# EAGLE design Programmable DC Load (EAGLE 9.6.2)

## Sheet 1 of 2
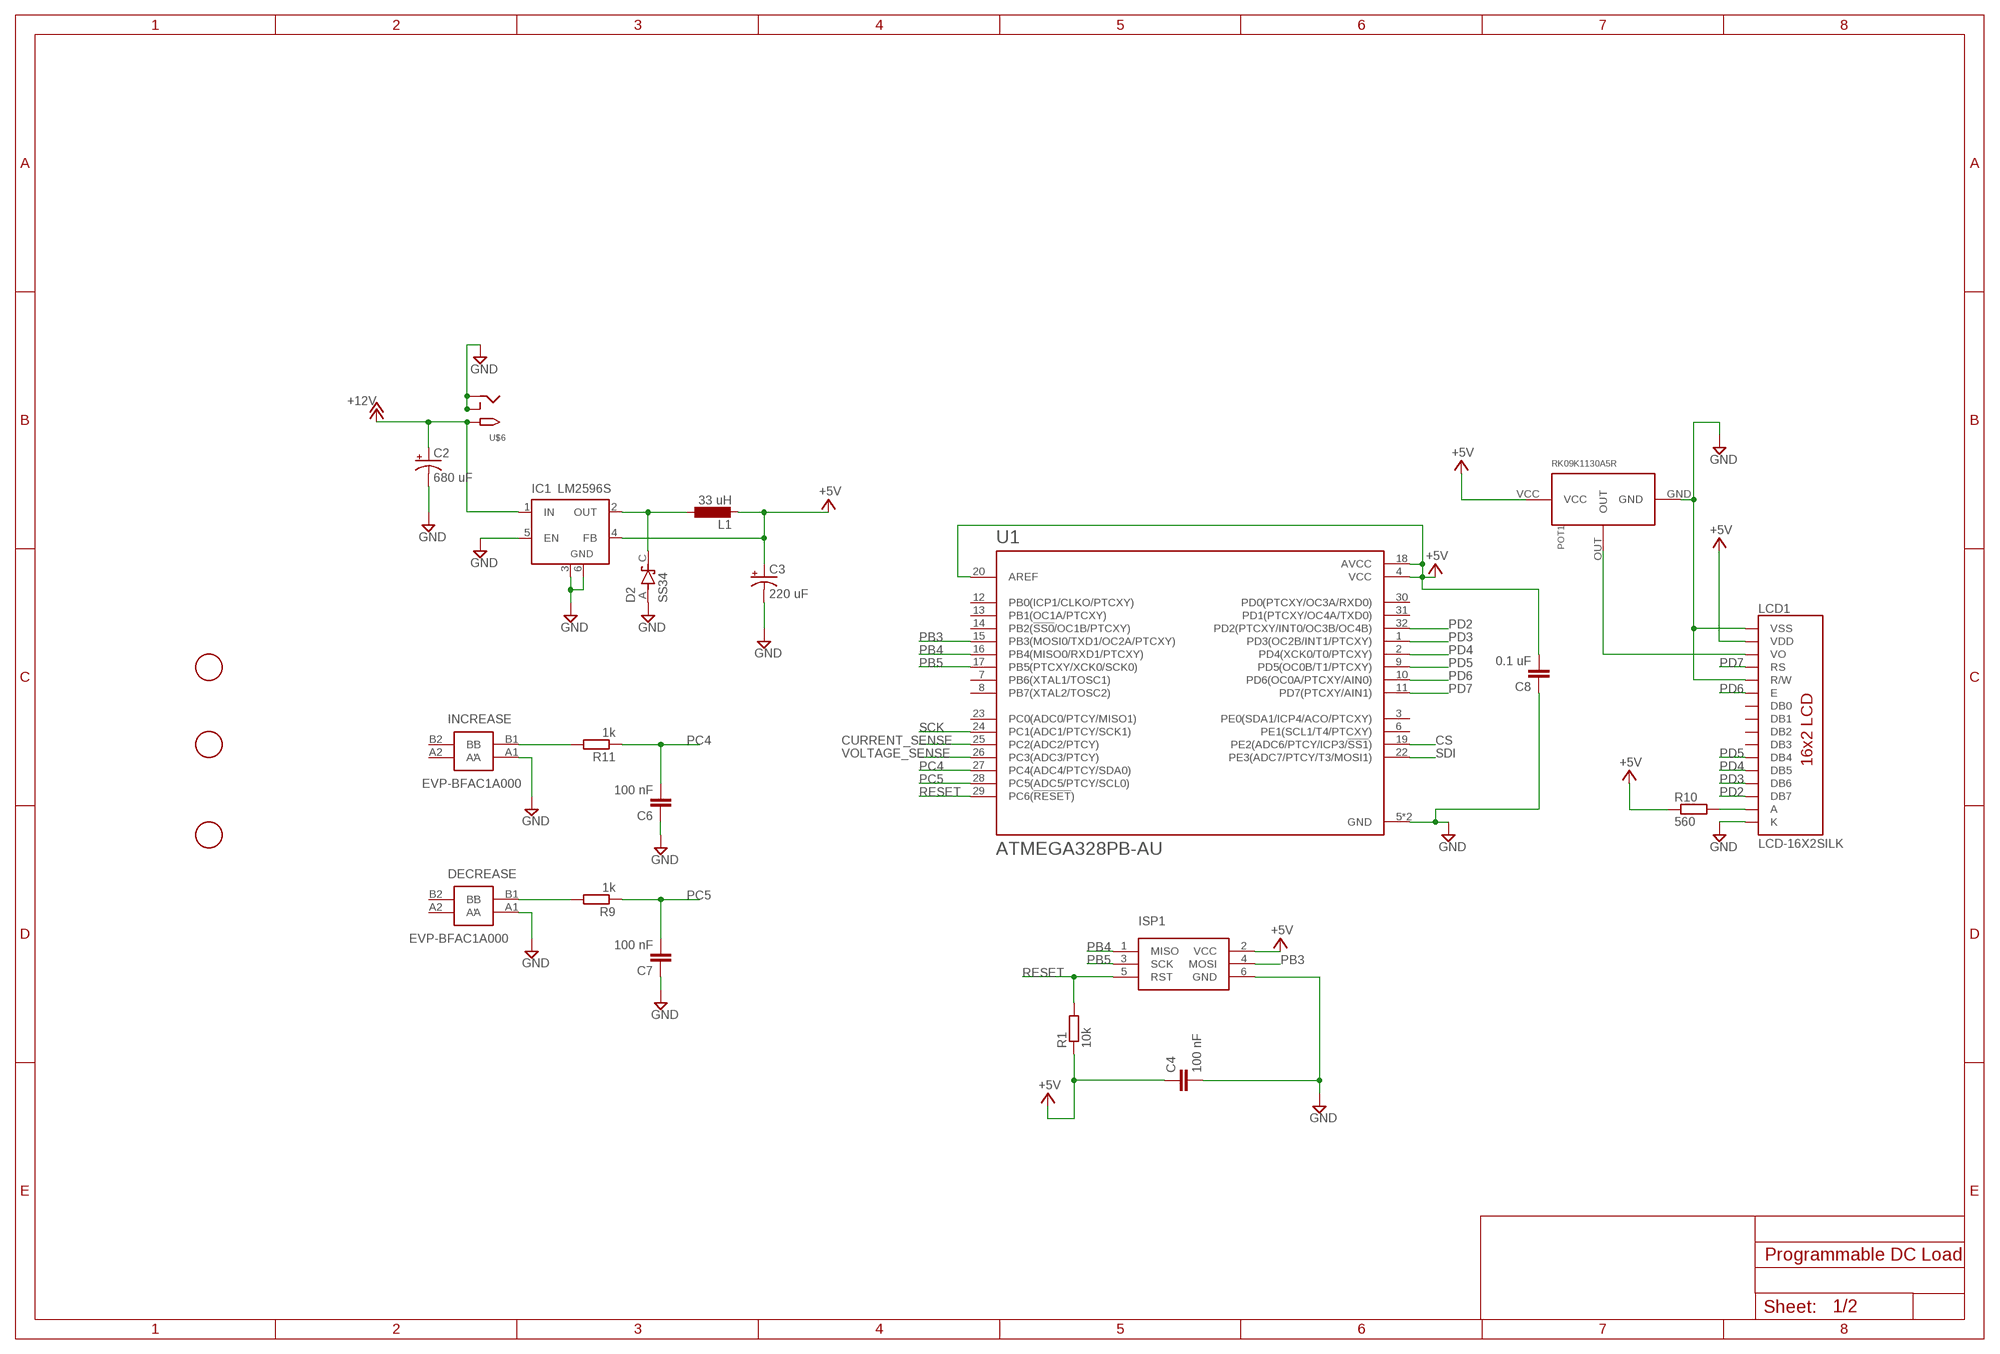
[diagram p0: schematic, sheet 1]

### Parts
C2  680 uF  CPOL-US140CLH-0810  [140CLH-0810]
C3  220 uF  CPOL-US140CLH-0810  [140CLH-0810]
C4  100 nF  C-EUC0805  [C0805]
C6  100 nF  C-EUC0805  [C0805]
C7  100 nF  C-EUC0805  [C0805]
C8  0.1 uF  C-EUC0805  [C0805]
D2  SS34  [DIOM7959X265N]
DECREASE  EVP-BFAC1A000  [EVPBFAC1A000]
IC1  LM2596S  [TO263-5]
INCREASE  EVP-BFAC1A000  [EVPBFAC1A000]
ISP1  AVRISP-6  [AVRISP]
L1  33 uH  L-EUL1812  [L1812]
LCD1  LCD-16X2SILK  [LCD-16X2]
POT1  RK09K1130A5R  [RK09K1130A5R]
R1  10k  R-EU_R0805  [R0805]
R9  1k  R-EU_R0805  [R0805]
R10  560  R-EU_R0805  [R0805]
R11  1k  R-EU_R0805  [R0805]
U1  ATMEGA328PB-AU  [QFP80P900X900X120-32N]
U$2  FIDUCIAL  [FIDUCIAL_1MM]
U$3  FIDUCIAL  [FIDUCIAL_1MM]
U$4  FIDUCIAL  [FIDUCIAL_1MM]
U$6  2.1MMJACKTHM  [PJ-102A]

### Nets
+5V: C3.+ C4.1 C8.2 IC1.4(FB) ISP1.2(VCC) L1.2 LCD1.2(VDD) POT1.VCC R1.1 R10.1 U1.4(VCC) U1.18(AVCC) U1.20(AREF) ; also sheet 2
+12V: C2.+ IC1.1(IN) U$6.TIP ; also sheet 2
CS: U1.19(PE2(ADC6/PTCY/ICP3/!SS1!)) ; also sheet 2
CURRENT_SENSE: U1.25(PC2(ADC2/PTCY)) ; also sheet 2
GND: C2.- C3.- C4.2 C6.1 C7.1 C8.1 D2.A DECREASE.A1(A) IC1.3(GND) IC1.5(EN) IC1.6(GND) INCREASE.A1(A) ISP1.6(GND) LCD1.1(VSS) LCD1.5(R/W) LCD1.16(K) POT1.GND U1.5(GND) U1.21(GND) U$6.RING U$6.RING_SW ; also sheet 2
N$3: LCD1.15(A) R10.2
N$4: D2.C(K) IC1.2(OUT) L1.1
N$6: DECREASE.B1(B) R9.2
N$8: INCREASE.B1(B) R11.2
N$12: LCD1.3(VO) POT1.OUT
PB3: ISP1.4(MOSI) U1.15(PB3(MOSI0/TXD1/OC2A/PTCXY))
PB4: ISP1.1(MISO) U1.16(PB4(MISO0/RXD1/PTCXY))
PB5: ISP1.3(SCK) U1.17(PB5(PTCXY/XCK0/SCK0))
PC4: C6.2 R11.1 U1.27(PC4(ADC4/PTCY/SDA0))
PC5: C7.2 R9.1 U1.28(PC5(ADC5/PTCY/SCL0))
PD2: LCD1.14(DB7) U1.32(PD2(PTCXY/INT0/OC3B/OC4B))
PD3: LCD1.13(DB6) U1.1(PD3(OC2B/INT1/PTCXY))
PD4: LCD1.12(DB5) U1.2(PD4(XCK0/T0/PTCXY))
PD5: LCD1.11(DB4) U1.9(PD5(OC0B/T1/PTCXY))
PD6: LCD1.6(E) U1.10(PD6(OC0A/PTCXY/AIN0))
PD7: LCD1.4(RS) U1.11(PD7(PTCXY/AIN1))
RESET: ISP1.5(RST) R1.2 U1.29(PC6(!RESET!))
SCK: U1.24(PC1(ADC1/PTCY/SCK1)) ; also sheet 2
SDI: U1.22(PE3(ADC7/PTCY/T3/MOSI1)) ; also sheet 2
VOLTAGE_SENSE: U1.26(PC3(ADC3/PTCY)) ; also sheet 2
Unconnected: DECREASE.A2(A') DECREASE.B2(B') INCREASE.A2(A') INCREASE.B2(B') LCD1.7(DB0) LCD1.8(DB1) LCD1.9(DB2) LCD1.10(DB3) U1.3(PE0(SDA1/ICP4/ACO/PTCXY)) U1.6(PE1(SCL1/T4/PTCXY)) U1.7(PB6(XTAL1/TOSC1)) U1.8(PB7(XTAL2/TOSC2)) U1.12(PB0(ICP1/CLKO/PTCXY)) U1.13(PB1(OC1A/PTCXY)) U1.14(PB2(!SS0!/OC1B/PTCXY)) U1.23(PC0(ADC0/PTCY/MISO1)) U1.30(PD0(PTCXY/OC3A/RXD0)) U1.31(PD1(PTCXY/OC4A/TXD0))

## Sheet 2 of 2
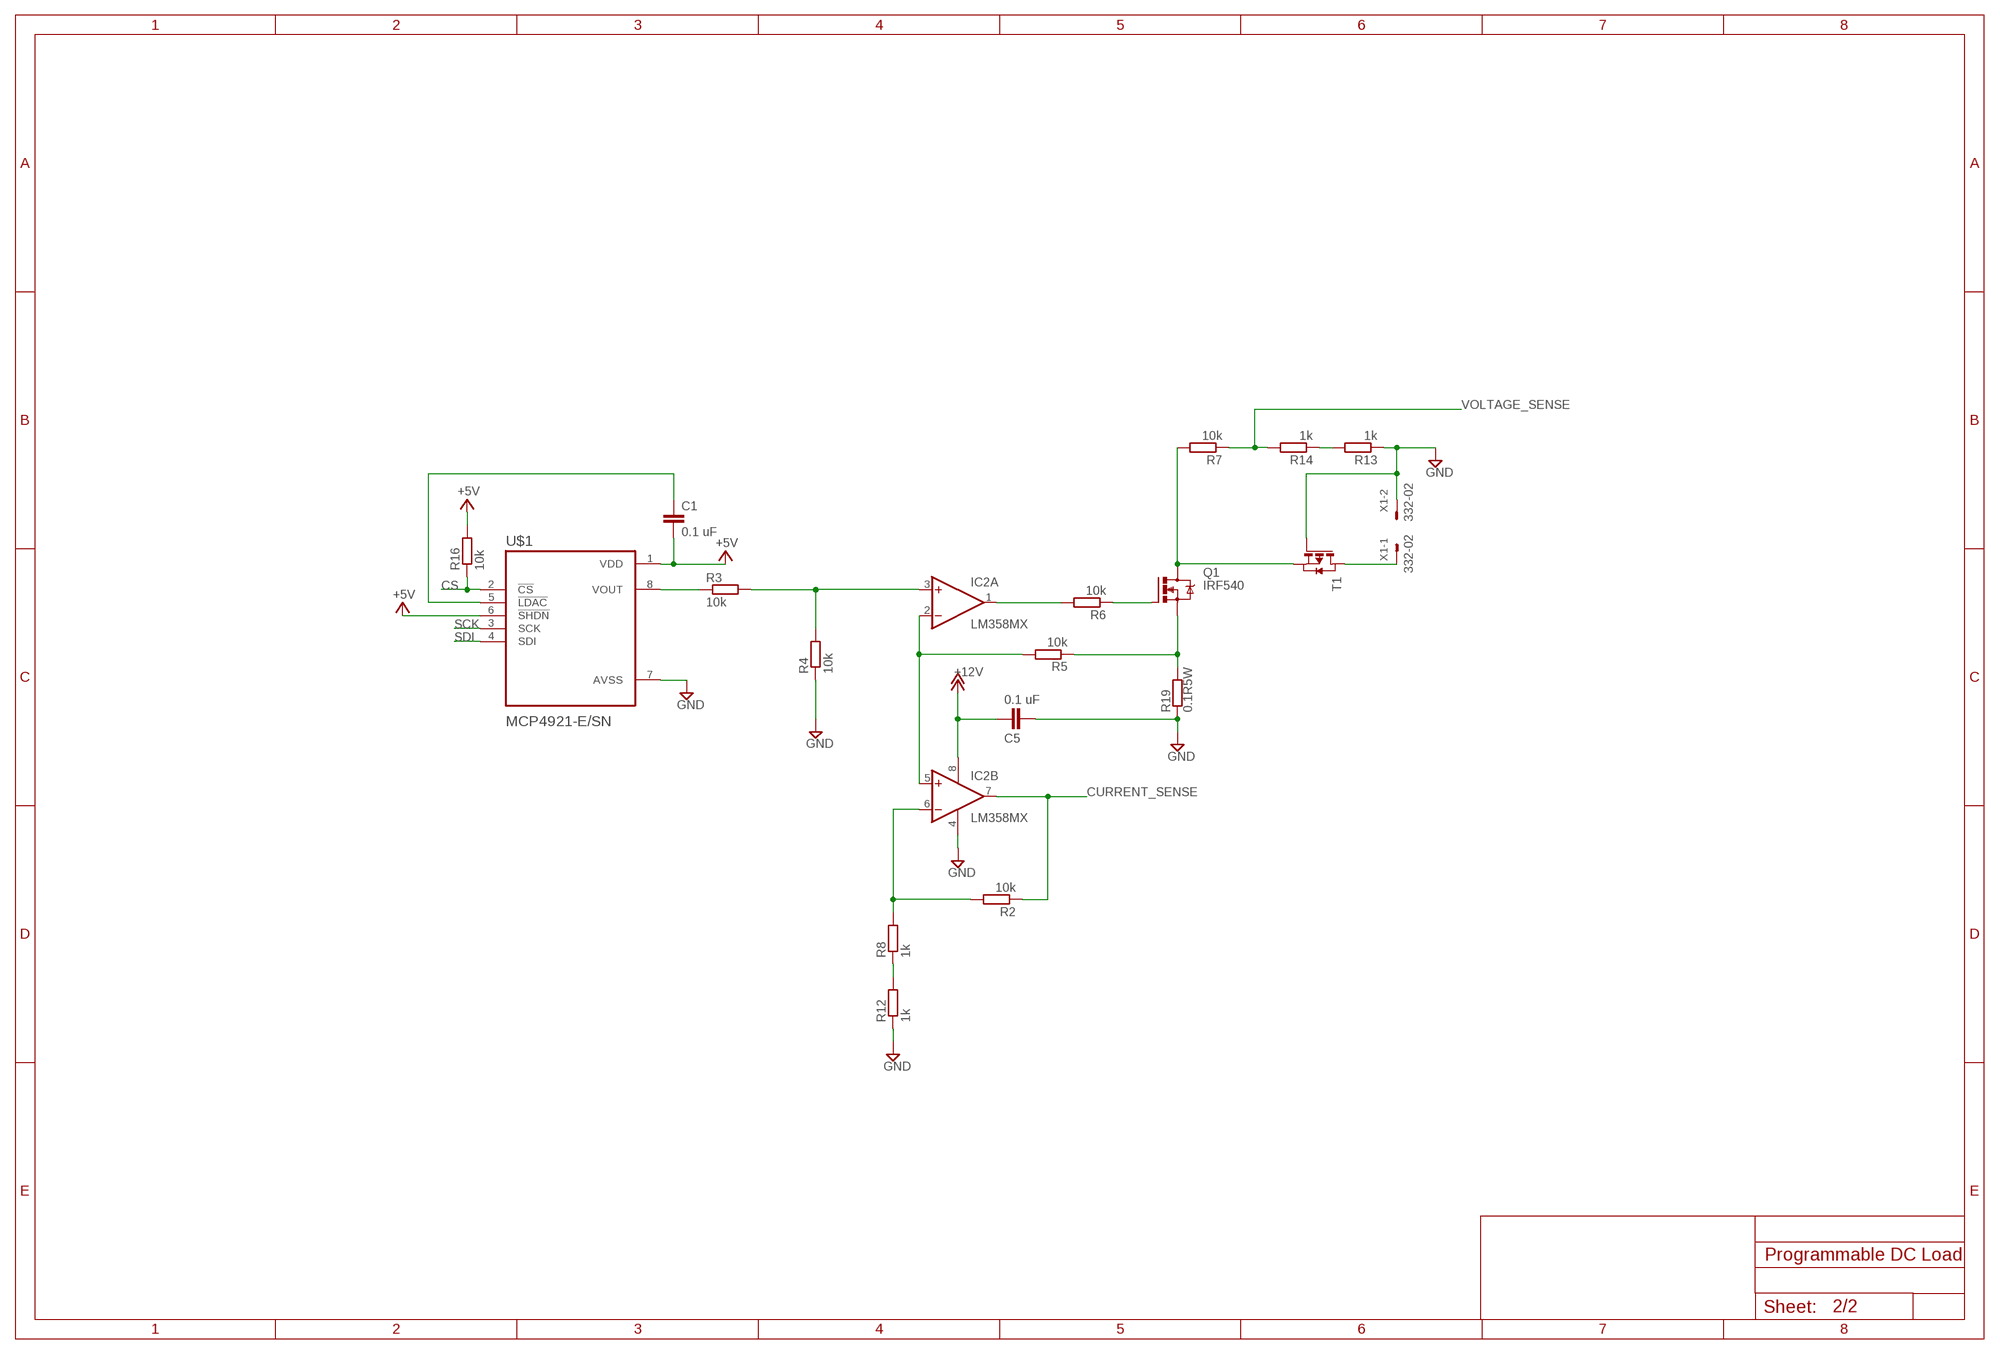
[diagram p1: schematic, sheet 2]

### Parts
C1  0.1 uF  C-EUC0805  [C0805]
C5  0.1 uF  C-EUC0805  [C0805]
IC2  LM358MX  [SO08]
Q1  IRF540  [TO220BV]
R2  10k  R-EU_R0805  [R0805]
R3  10k  R-EU_R0805  [R0805]
R4  10k  R-EU_R0805  [R0805]
R5  10k  R-EU_R0805  [R0805]
R6  10k  R-EU_R0805  [R0805]
R7  10k  R-EU_R0805  [R0805]
R8  1k  R-EU_R0805  [R0805]
R12  1k  R-EU_R0805  [R0805]
R13  1k  R-EU_R0805  [R0805]
R14  1k  R-EU_R0805  [R0805]
R16  10k  R-EU_R0805  [R0805]
R19  0.1R5W  BVS  [BVS]
T1  PMOSSOT23  [SOT-23]
U$1  MCP4921-E/SN  [SOIC127P600X175-8N]
X1  332-02  [332-02]

### Nets
+5V: C1.2 R16.2 U$1.1(VDD) U$1.6(!SHDN) ; also sheet 1
+12V: C5.2 IC2.8(P:V+) ; also sheet 1
CS: R16.1 U$1.2(!CS) ; also sheet 1
CURRENT_SENSE: IC2.7(B:OUT) R2.1 ; also sheet 1
GND: C5.1 IC2.4(P:V-) R4.1 R12.1 R13.1 R19.2 T1.3(G) U$1.7(AVSS) X1.2 ; also sheet 1
N$1: R8.1 R12.2
N$2: R13.2 R14.1
N$5: T1.1(D) X1.1
N$10: IC2.3(A:+IN) R3.2 R4.2
N$16: IC2.1(A:OUT) R6.2
N$18: Q1.G R6.1
N$19: IC2.2(A:-IN) IC2.5(B:+IN) R5.2
N$20: Q1.S R5.1 R19.1
N$21: Q1.D R7.2 T1.2(S)
N$22: IC2.6(B:-IN) R2.2 R8.2
N$23: R3.1 U$1.8(VOUT)
N$24: C1.1 U$1.5(!LDAC)
SCK: U$1.3(SCK) ; also sheet 1
SDI: U$1.4(SDI) ; also sheet 1
VOLTAGE_SENSE: R7.1 R14.2 ; also sheet 1

## Library data of the parts
C1 C4-C8 = rcl:C-EU: CAPACITOR, European symbol; SPICEPREFIX: C
C2 C3 = rcl:CPOL-US: POLARIZED CAPACITOR, American symbol; SPICEPREFIX: C
D2 = SS34:SS34: Diode Schottky 40V 3A 2-Pin SMC T/R Check prices <https://pricing.snapeda.com/parts/SS34/ON%20Semiconductor/view-part?ref=eda>; AVAILABILITY: Good; DESCRIPTION: Diode Schottky 40V 3A Surface Mount SMC (DO-214AB); MF: ON Semiconductor; MP: SS34; PACKAGE: SMC-2 ON Semiconductor; PRICE: None; PURCHASE-URL: https://pricing.snapeda.com/search/part/SS34/?ref=eda
DECREASE INCREASE = EVP-BFAC1A000:EVP-BFAC1A000: Tactile Switches 6.0x6.0x3.4mm 2N w/4 Term .25mm Trvl IP67 Source: Datasheet <https://industrial.panasonic.com/cdbs/www-data/pdf/ATK0000/ATK0000C432.pdf> Check prices <https://pricing.snapeda.com/parts/EVP-BFAC1A000/Panasonic%20Electronic/view-part?ref=eda>; AVAILABILITY: Warning; DESCRIPTION: Tactile Switch SPST-NO Top Actuated Surface Mount; MF: Panasonic Electronic; MP: EVP-BFAC1A000; PACKAGE: None; PRICE: None; PURCHASE-URL: https://pricing.snapeda.com/search/part/EVP-BFAC1A000/?ref=eda
IC1 = linear:LM2596S: STEP-DOWN VOLTAGE REGULATOR
IC2 = linear:LM358: OP AMP also LM158; LM258; LM2904 Source: http://cache.national.com/ds/LM/LM158.pdf
ISP1 = ECE388:AVRISP: AVR ISP HEADER Standard 6 pin header for AVR programming
L1 = rcl:L-EU: INDUCTOR, European symbol; SPICEPREFIX: L
LCD1 = SparkFun-Displays:LCD-16X2: Standard text-only 16x2 parallel input LCD Basic 16 character by 2 line display. Typically utilizes the extremely common HD44780 parallel interface chipset SparkFun Products: Basic 16x2 Green <https://www.sparkfun.com/products/255> Basic 8x2 Green <https://www.sparkfun.com/products/11122>; PROD_ID: LCD-12633; SF_ID: LCD-00255
POT1 = RK09K1130A5R:RK09K1130A5R
Q1 = transistor-power:IRF540: HEXFET Power MOSFET
R1-R14 R16 = rcl:R-EU_: RESISTOR, European symbol; SPICEPREFIX: R
R19 = resistor-shunt:BVS: SMD SHUNT RESISTOR; OC_FARNELL: unknown; OC_NEWARK: unknown
T1 = zetex:PMOSSOT23: MOS FET; OC_FARNELL: unknown; OC_NEWARK: unknown
U1 = ATMEGA328PB-AU:ATMEGA328PB-AU: ATmega Series 20 MHz 32 KB Flash 2 KB SRAM 8-Bit Microcontroller - TQFP-32 Check prices <https://pricing.snapeda.com/search/part/ATMEGA328PB-AU/?ref=eda>; AVAILABILITY: Good; DESCRIPTION: 8-bit Microcontrollers - MCU ATMEGA328PB 20MHZ IND TEMP; MF: Microchip Technology / Atmel; MP: ATMEGA328PB-AU; PACKAGE: None; PRICE: None; PURCHASE-URL: https://pricing.snapeda.com/search/part/ATMEGA328PB-AU/?ref=eda
U$1 = MCP4921-E_SN:MCP4921-E/SN: Check prices <https://pricing.snapeda.com/parts/MCP4921-E/SN/Microchip/view-part?ref=eda>; AVAILABILITY: Good; DESCRIPTION: 12 Bit Digital to Analog Converter 1 8-SOIC; MF: Microchip; MP: MCP4921-E/SN; PACKAGE: SOIC-8 Microchip; PRICE: None; PURCHASE-URL: https://pricing.snapeda.com/search/part/MCP4921-E/SN/?ref=eda
U$2-U$4 = ECE388:FIDUCIAL: For use by pick and place machines to calibrate the vision/machine, 1mm By microbuilder.eu
U$6 = ECE388:2.1MMJACK: 2.1mm x 5.5mm THM DC jack with internal switch. Digikey part #PJ-102A, 4UCON part #05537 2.1mm x 5.5mm SMT DC jack with internal switch. Digikey part #PJ-002A-SMT, 4UCON part #03267 By microbuilder.eu & adafruit.com
X1 = con-garry:332-02: 2 Pin - 2mm Dual Row Source: www.mpe-connector.de / garry_shortform_2012.pdf

## Board
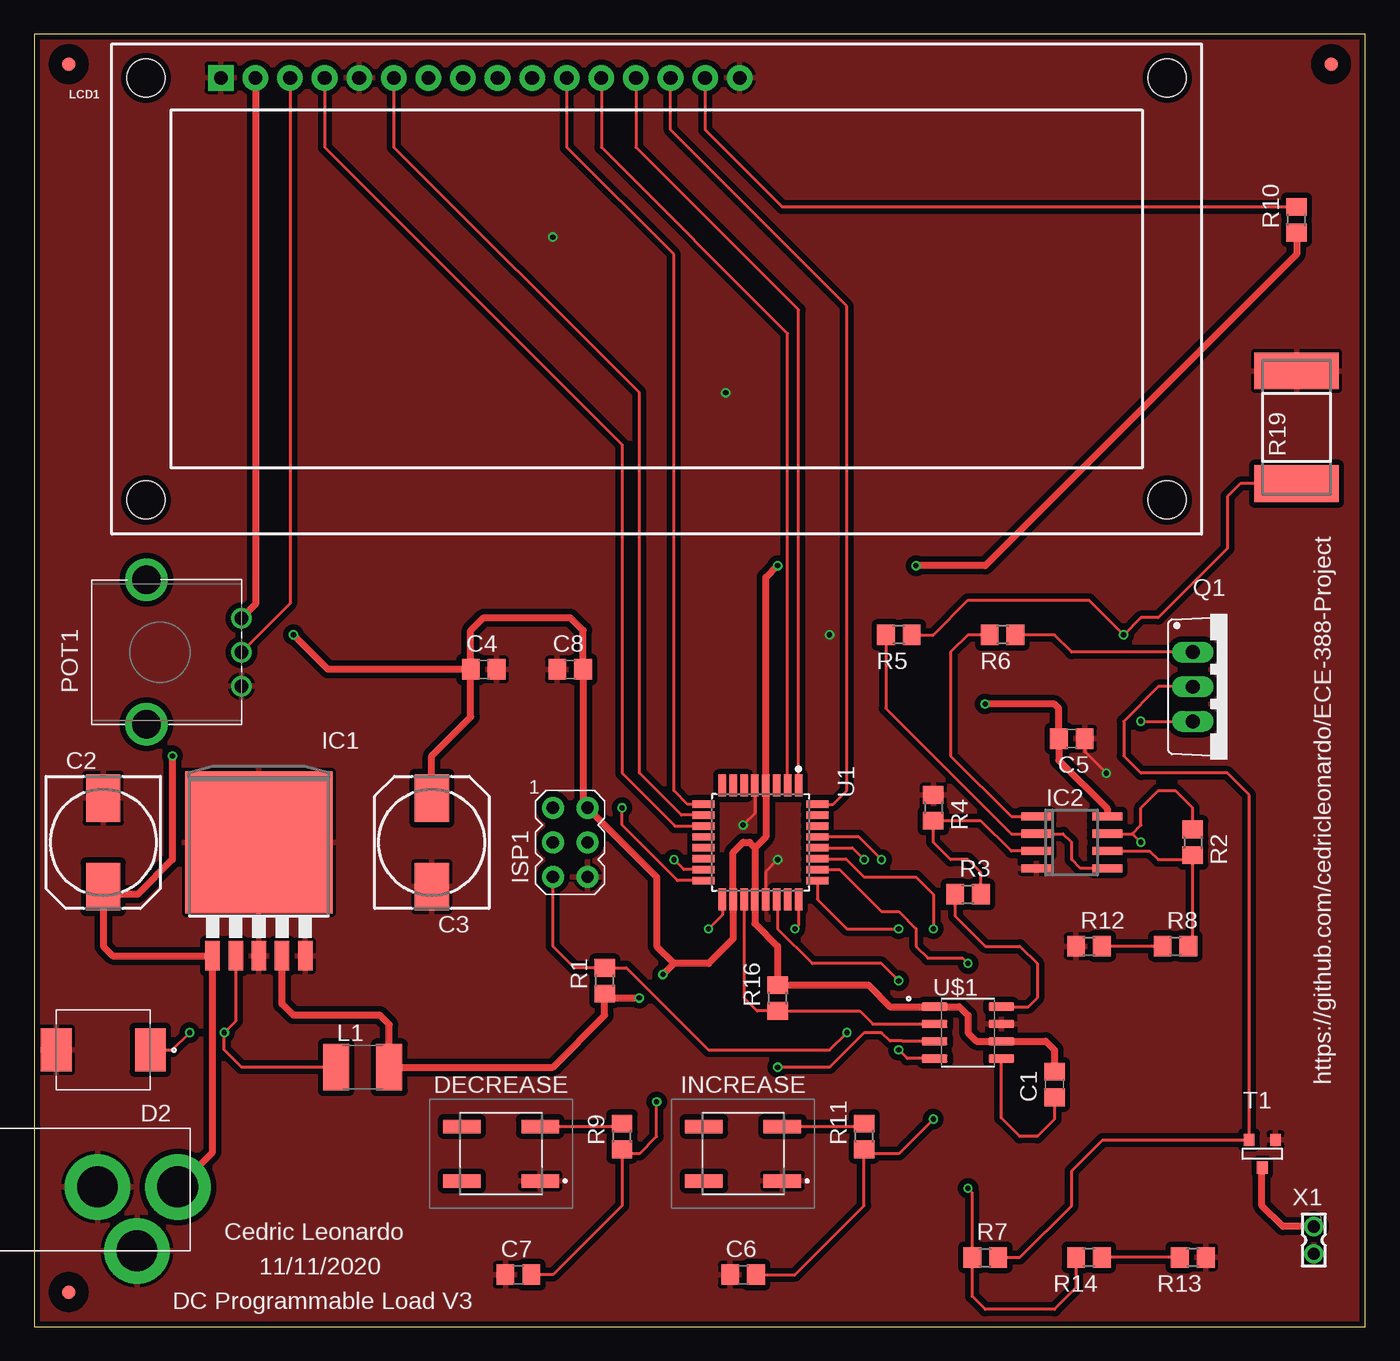
[diagram p2: board, top side]
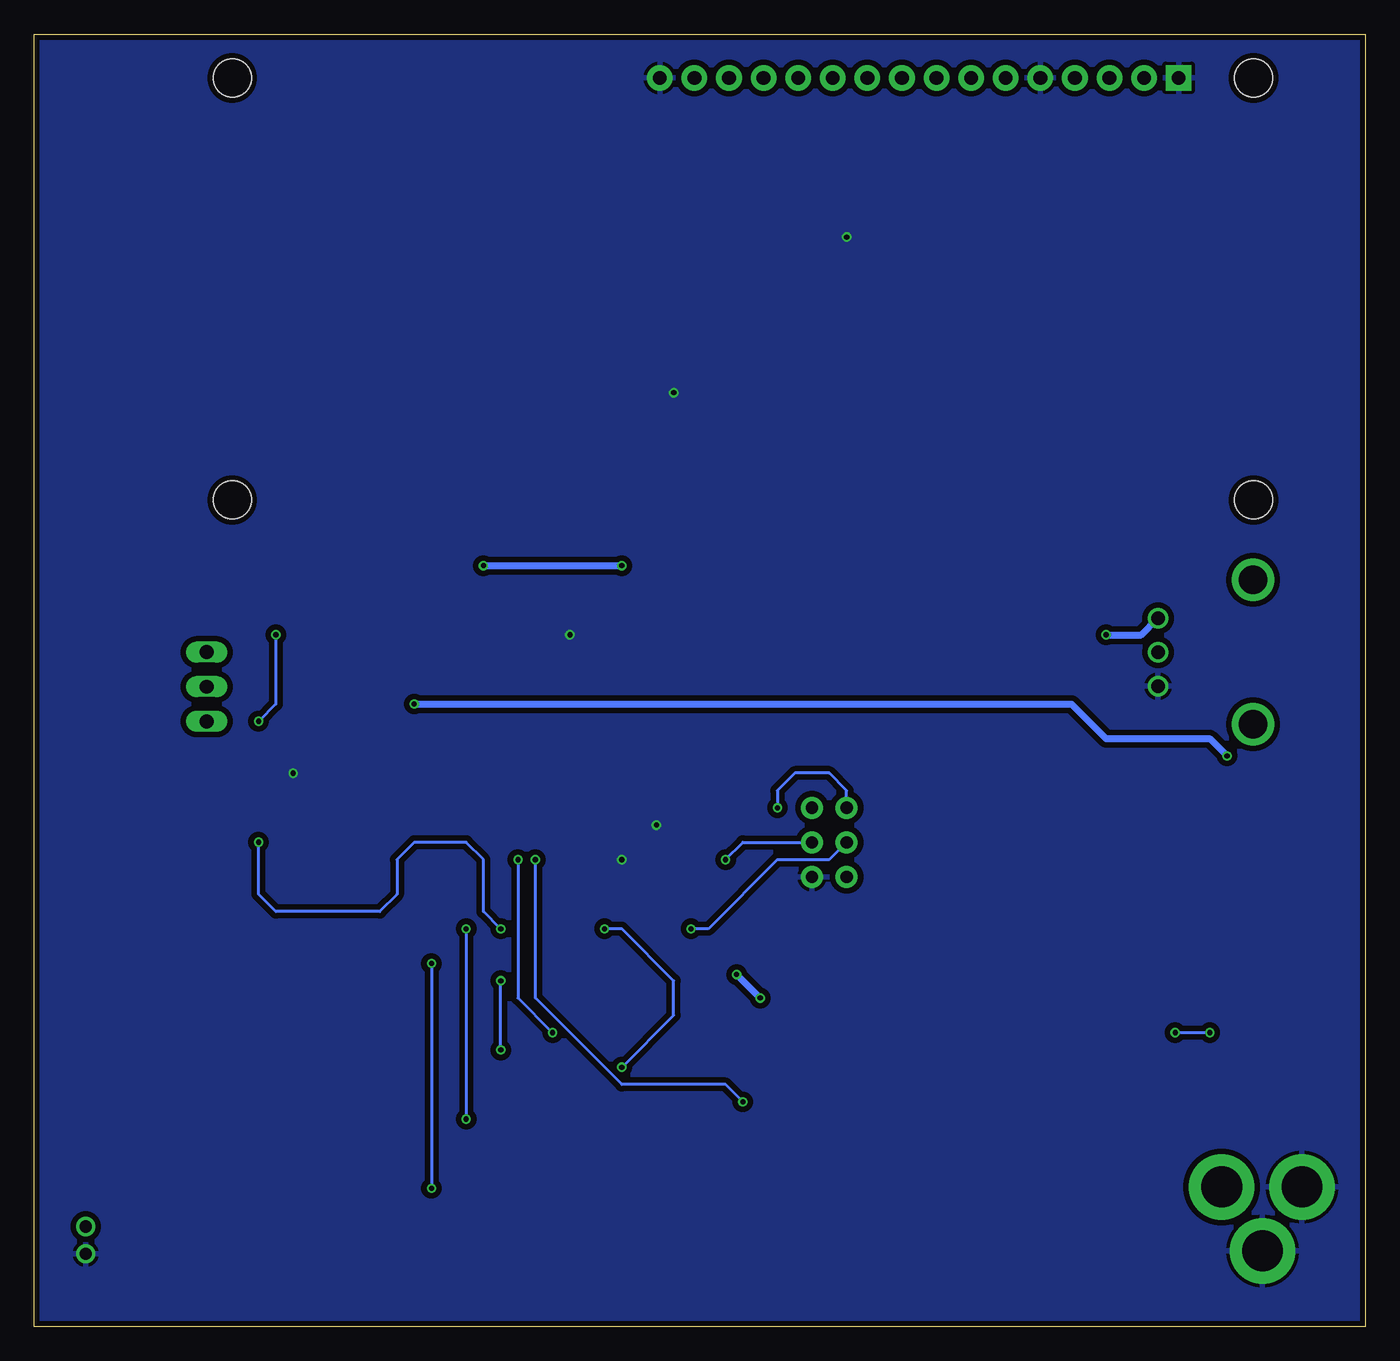
[diagram p3: board, bottom side, seen from below]

Size 97.77 x 94.92 mm. Coordinates in mm from the lower left corner, seen from the top.
Outline: 0,0 97.77,0 97.77,94.92 0,94.92 0,0
Copper layers (1*16): Top 0.035mm / dielectric 1.5mm / Bottom 0.035mm
Design rules "Dirty8TS": minimum track width 8mil, minimum drill 15mil, track to track 8mil, track to pad 8mil, pad to pad 8mil, via to via 8mil, smd to smd 0mil, copper to edge 10mil, drill to drill 10mil, minimum pad ring 10mil, minimum via ring 6mil, stop-mask expansion 2mil, vias tented up to drill 25mil, thermal gap 10mil

### Footprints (pad centres in the part's own frame; a part is rotated, then mirrored left to right if it is on the bottom)
C0805 = smd 1.3 x 1.5: 1 -0.95,0; 2 0.95,0
140CLH-0810 = smd 3.5 x 2.5: + 3.25,0; - -3.25,0
DIOM7959X265N = smd 2.25 x 3.18: A 3.455,0; C -3.455,0
EVPBFAC1A000 = smd 2.75 x 1: A1 2.875,-2; A2 -2.875,-2; B1 2.875,2; B2 -2.875,2
TO263-5 = smd 1.067 x 2.159: 1 -3.404,-5.791; 2 -1.702,-5.791; 3 0,-5.791; 4 1.702,-5.791; 5 3.404,-5.791 | smd 10.8 x 10.41: 6 0,2.54
SO08 = smd 0.6 x 2.2: 1 -1.905,-2.6; 2 -0.635,-2.6; 3 0.635,-2.6; 4 1.905,-2.6; 5 1.905,2.6; 6 0.635,2.6; 7 -0.635,2.6; 8 -1.905,2.6
AVRISP = drill 0.9 pad 1.626: 1 -1.27,2.54; 2 1.27,2.54; 3 -1.27,0; 4 1.27,0; 5 -1.27,-2.54; 6 1.27,-2.54
L1812 = smd 1.9 x 3.4: 1 -1.95,0; 2 1.95,0
LCD-16X2 = drill 1.016 pad 1.88 square: 1 -32,15.5 | drill 1.016 pad 1.88: 2 -29.46,15.5; 3 -26.92,15.5; 4 -24.38,15.5; 5 -21.84,15.5; 6 -19.3,15.5; 7 -16.76,15.5; 8 -14.22,15.5; 9 -11.68,15.5; 10 -9.14,15.5; 11 -6.6,15.5; 12 -4.06,15.5; 13 -1.52,15.5; 14 1.02,15.5; 15 3.56,15.5; 16 6.1,15.5 | hole 2.8: -37.5,15.5; -37.5,-15.5; 37.5,15.5; 37.5,-15.5
RK09K1130A5R = drill 2.1: 1 -5.3,7; 2 5.3,7 | drill 1: GND -2.5,0; OUT 0,0; VCC 2.5,0
TO220BV = drill 1.016 long: D 0,-2.54; G -2.54,-2.54; S 2.54,-2.54
R0805 = smd 1.3 x 1.5: 1 -0.95,0; 2 0.95,0
BVS = smd 2.7 x 6.2: 1 -4.14,0; 2 4.14,0
SOT-23 = smd 0.787 x 0.889: 1 0.025,-1.016; 2 -0.94,1.016; 3 0.991,1.016
QFP80P900X900X120-32N = smd 1.6 x 0.55: 1 -4.18,2.8; 2 -4.18,2; 3 -4.18,1.2; 4 -4.18,0.4; 5 -4.18,-0.4; 6 -4.18,-1.2; 7 -4.18,-2; 8 -4.18,-2.8; 17 4.18,-2.8; 18 4.18,-2; 19 4.18,-1.2; 20 4.18,-0.4; 21 4.18,0.4; 22 4.18,1.2; 23 4.18,2; 24 4.18,2.8 | smd 0.55 x 1.6: 9 -2.8,-4.18; 10 -2,-4.18; 11 -1.2,-4.18; 12 -0.4,-4.18; 13 0.4,-4.18; 14 1.2,-4.18; 15 2,-4.18; 16 2.8,-4.18; 25 2.8,4.18; 26 2,4.18; 27 1.2,4.18; 28 0.4,4.18; 29 -0.4,4.18; 30 -1.2,4.18; 31 -2,4.18; 32 -2.8,4.18
SOIC127P600X175-8N = smd 1.9 x 0.6: 1 -2.455,1.905; 2 -2.455,0.635; 3 -2.455,-0.635; 4 -2.455,-1.905; 5 2.455,-1.905; 6 2.455,-0.635; 7 2.455,0.635; 8 2.455,1.905
FIDUCIAL_1MM = smd 1 x 1: 1 0,0
PJ-102A = drill 3 pad 4.8: RING 0.1,-3.39; RING_SW -4.6,-6.29; TIP 0.1,-9.29
332-02 = drill 0.9 pad 1.27: 1 0,-1; 2 0,1

### Placement (x,y rotation side)
C1  74.93,17.78 90 top
C2  5.08,35.56 270 top
C3  29.21,35.56 90 top
C4  33.02,48.26 0 top
C5  76.2,43.18 180 top
C6  52.07,3.81 0 top
C7  35.56,3.81 0 top
C8  39.37,48.26 0 top
D2  5.08,20.32 180 top
DECREASE  34.29,12.7 0 top
IC1  16.51,33.02 0 top
IC2  76.2,35.56 270 top
INCREASE  52.07,12.7 0 top
ISP1  39.37,35.56 0 top
L1  24.13,19.05 0 top
LCD1  45.72,76.2 0 top
POT1  15.24,49.53 90 top
Q1  87.63,46.99 270 top
R1  41.91,25.4 90 top
R2  85.09,35.56 270 top
R3  68.58,31.75 0 top
R4  66.04,38.1 270 top
R5  63.5,50.8 180 top
R6  71.12,50.8 180 top
R7  69.85,5.08 0 top
R8  83.82,27.94 0 top
R9  43.18,13.97 90 top
R10  92.71,81.28 90 top
R11  60.96,13.97 90 top
R12  77.47,27.94 0 top
R13  85.09,5.08 180 top
R14  77.47,5.08 180 top
R16  54.61,24.13 90 top
R19  92.71,66.04 90 top
T1  90.17,12.7 0 top
U1  53.34,35.56 270 top
U$1  68.58,21.59 0 top
U$2  95.25,92.71 0 top
U$3  2.54,2.54 0 top
U$4  2.54,92.71 0 top
U$6  1.27,10.16 90 top
X1  93.98,6.35 180 top

### Tracks (layer width: path | path; a pad name or v marks a point on that pad's centre or on a via)
+5V  (via drill 0.38)
  Top 0.508: IC1.4 18.21,23.7 19.05,22.86 25.4,22.86 26.08,22.18 L1.2 38.1,19.05 41.91,22.86 R1.1 42.23,24.13 v44.45,24.13 | C3.+ 29.21,41.91 32.07,44.77 C4.1 | C4.1 32.07,51.12 33.02,52.07 39.37,52.07 40.32,51.12 C8.2 40.32,38.42 ISP1.2 45.72,33.02 45.72,27.94 46.99,26.67 | C4.1 21.59,48.26 v19.05,50.8 | LCD1.2 16.26,53.05 POT1.VCC | 52.94,35.16 U1.20 52.94,29.61 54.61,27.94 R16.2 61.28,25.08 62.87,23.5 U$1.1 67.94,23.5 68.58,22.86 68.58,21.59 69.22,20.95 U$1.6 74.3,20.95 74.93,20.32 C1.2 | 52.94,35.16 53.74,35.96 U1.4 53.74,55.01 v54.61,55.88 | 52.94,35.16 52.54,35.56 52.07,35.56 51.34,34.83 U1.18 51.34,28.48 49.53,26.67 46.99,26.67 | R10.1 92.71,78.74 69.85,55.88 v64.77,55.88 | v46.18,25.86 46.99,26.67
  Bottom 0.508: POT1.VCC 16.47,50.8 v19.05,50.8 | v64.77,55.88 v54.61,55.88 | v44.45,24.13 v46.18,25.86
+12V  (via drill 0.38)
  Top 0.508: C2.+ 5.08,31.75 | 5.08,31.75 5.08,27.94 5.79,27.23 IC1.1 13.11,12.81 U$6.TIP | IC2.8 78.8,38.04 75.25,41.59 C5.2 75.25,44.45 75.25,45.4 74.93,45.72 v69.85,45.72 | v10.16,41.91 10.16,34.29 7.62,31.75 5.08,31.75
  Bottom 0.508: v10.16,41.91 11.43,43.18 19.05,43.18 21.59,45.72 v69.85,45.72
CS
  Top 0.203: U$1.2 61.59,22.23 60.64,23.18 R16.1 53.09,23.18 52.14,24.13 U1.19
CURRENT_SENSE  (via drill 0.38)
  Top 0.203: R2.1 85.09,38.1 83.82,39.37 82.55,39.37 81.28,38.1 81.28,36.83 80.64,36.2 | IC2.7 80.64,36.2 | U1.25 57.52,31.38 59.69,29.21 v63.5,29.21 | v81.28,35.57 80.66,36.2 80.64,36.2
  Bottom 0.203: v63.5,29.21 64.77,30.48 64.77,34.29 66.04,35.56 69.85,35.56 71.12,34.29 71.12,31.75 72.39,30.48 80.01,30.48 81.28,31.75 v81.28,35.57
GND  (via drill 0.38)
  Top 0.203: U1.21 53.74,33.42 v54.61,34.29 | U1.5 52.94,37.7 v52.07,36.83 | C5.1 77.15,42.23 v78.74,40.64
  other vias: 50.8,68.58 38.1,80.01 58.42,50.8
  pour Bottom (isolate 0.406): 0,95.25 97.79,95.25 97.79,0 0,0
  pour Top (isolate 0.406): 0,95.25 97.79,95.25 97.79,0 0,0
N$1
  Top 0.203: R8.1 R12.2
N$2
  Top 0.203: R13.2 R14.1
N$3
  Top 0.203: LCD1.15 49.28,87.88 54.93,82.23 R10.2
N$4  (via drill 0.38)
  Top 0.203: D2.C 10.16,20.32 v11.43,21.59 | IC1.2 14.81,22.43 v13.97,21.59 13.97,20.32 15.24,19.05 L1.1
  Bottom 0.203: v11.43,21.59 v13.97,21.59
N$5
  Top 0.508: X1.1 91.71,7.35 90.17,8.89 90.17,11.66 T1.1
N$6
  Top 0.203: DECREASE.B1 42.96,14.7 R9.2
N$8
  Top 0.203: INCREASE.B1 60.74,14.7 R11.2
N$10
  Top 0.203: IC2.3 71.75,34.92 69.53,37.15 R4.2 66.04,35.56 67.31,34.29 68.58,34.29 69.53,33.34 69.53,33.02 R3.2
N$12
  Top 0.203: LCD1.3 18.8,53.09 POT1.OUT
N$16
  Top 0.203: R6.2 68.58,50.8 67.31,49.53 67.31,41.91 71.75,37.47 IC2.1
N$18
  Top 0.203: Q1.G 76.2,49.53 74.93,50.8 R6.1
N$19
  Top 0.203: IC2.5 76.83,33.66 76.2,34.29 76.2,35.56 75.56,36.2 73.66,36.2 IC2.2 71.75,36.2 62.55,45.4 R5.2
N$20  (via drill 0.38)
  Top 0.203: R19.1 88.57,61.9 87.63,60.96 87.63,57.15 82.55,52.07 81.28,52.07 v80.01,50.8 77.47,53.34 68.58,53.34 66.04,50.8 R5.1 | v81.28,44.45 Q1.S
  Bottom 0.203: v81.28,44.45 80.01,45.72 v80.01,50.8
N$21
  Top 0.203: R7.2 72.39,5.08 76.2,8.89 76.2,11.43 78.49,13.72 T1.2 89.23,39.04 87.63,40.64 81.28,40.64 80.01,41.91 80.01,44.45 82.55,46.99 Q1.D
N$22
  Top 0.203: R8.2 85.09,28.26 85.09,34.29 | 85.09,34.29 R2.2 | IC2.6 81.92,34.92 82.55,34.29 85.09,34.29
N$23
  Top 0.203: U$1.8 73.03,23.5 73.66,24.13 73.66,26.67 72.39,27.94 69.85,27.94 67.63,30.16 R3.1
N$24
  Top 0.203: C1.1 74.93,15.24 73.66,13.97 72.39,13.97 71.03,15.32 U$1.5
PB3  (via drill 0.38)
  Top 0.203: U1.15 47.72,33.56 v46.99,34.29
  Bottom 0.203: v46.99,34.29 45.72,35.56 ISP1.4
PB4  (via drill 0.38)
  Top 0.203: U1.16 47.25,32.76 43.18,36.83 v43.18,38.1
  Bottom 0.203: ISP1.1 38.1,39.37 39.37,40.64 41.91,40.64 43.18,39.37 v43.18,38.1
PB5  (via drill 0.38)
  Top 0.203: U1.17 50.54,30.22 v49.53,29.21
  Bottom 0.203: ISP1.3 39.37,34.29 43.18,34.29 48.26,29.21 v49.53,29.21
PC4  (via drill 0.38)
  Top 0.203: C6.2 55.88,3.81 60.96,8.89 60.96,12.7 | 60.96,12.7 R11.1 | U1.27 59.62,34.36 60.96,33.02 64.77,33.02 66.04,31.75 v66.04,29.21 | v66.04,15.24 63.5,12.7 60.96,12.7
  Bottom 0.203: v66.04,29.21 v66.04,15.24
PC5  (via drill 0.38)
  Top 0.203: R9.1 43.18,12.7 | 43.18,12.7 43.18,8.89 38.1,3.81 C7.2 | U1.28 60.09,35.16 v60.96,34.29 | 43.18,12.7 44.45,12.7 45.72,13.97 v45.72,16.51
  Bottom 0.203: v60.96,34.29 60.96,24.13 54.61,17.78 46.99,17.78 v45.72,16.51
PD2
  Top 0.203: LCD1.14 46.74,87.88 59.69,74.93 59.69,39.37 58.68,38.36 U1.32
PD3
  Top 0.203: LCD1.13 44.2,86.61 56.14,74.67 U1.1
PD4
  Top 0.203: LCD1.12 41.66,86.61 55.34,72.93 U1.2
PD5
  Top 0.203: LCD1.11 39.12,86.61 46.99,78.74 46.99,39.37 48,38.36 U1.9
PD6
  Top 0.203: U1.10 47.53,37.56 44.45,40.64 44.45,68.58 26.42,86.61 LCD1.6
PD7
  Top 0.203: LCD1.4 21.34,86.61 43.18,64.77 43.18,40.64 47.06,36.76 U1.11
RESET  (via drill 0.38)
  Top 0.203: ISP1.5 38.1,27.94 39.69,26.35 R1.2 43.5,26.35 49.53,20.32 58.42,20.32 v59.69,21.59 | v62.23,34.29 60.56,35.96 U1.29
  Bottom 0.203: v59.69,21.59 62.23,24.13 v62.23,34.29
SCK  (via drill 0.38)
  Top 0.203: U$1.3 63.78,20.95 63.77,20.97 62.85,20.97 62.23,21.59 60.96,21.59 58.42,19.05 v54.61,19.05 | U1.24 56.14,29.47 v55.88,29.21
  Bottom 0.203: v54.61,19.05 50.8,22.86 50.8,25.4 54.61,29.21 v55.88,29.21
SDI  (via drill 0.38)
  Top 0.203: U1.22 54.61,31.31 54.61,29.21 57.15,26.67 62.23,26.67 v63.5,25.4 | U$1.4 64.14,19.68 v63.5,20.32
  Bottom 0.203: v63.5,20.32 v63.5,25.4
VOLTAGE_SENSE  (via drill 0.38)
  Top 0.203: R14.2 76.52,2.86 74.93,1.27 69.85,1.27 68.9,2.22 R7.1 68.9,9.84 v68.58,10.16 | U1.26 59.15,33.56 62.23,30.48 63.5,30.48 64.77,29.21 64.77,27.94 65.63,27.08 68.17,27.08 v68.58,26.67
  Bottom 0.203: v68.58,26.67 v68.58,10.16

### Text on the board
tPlace: https://github.com/cedricleonardo/ECE-388-Project | Cedric Leonardo | 11/11/2020 | DC Programmable Load V3